# Altium schematic sheet Power Regulation.SchDoc
size A; SheetNumber: 2; SheetTotal: 4
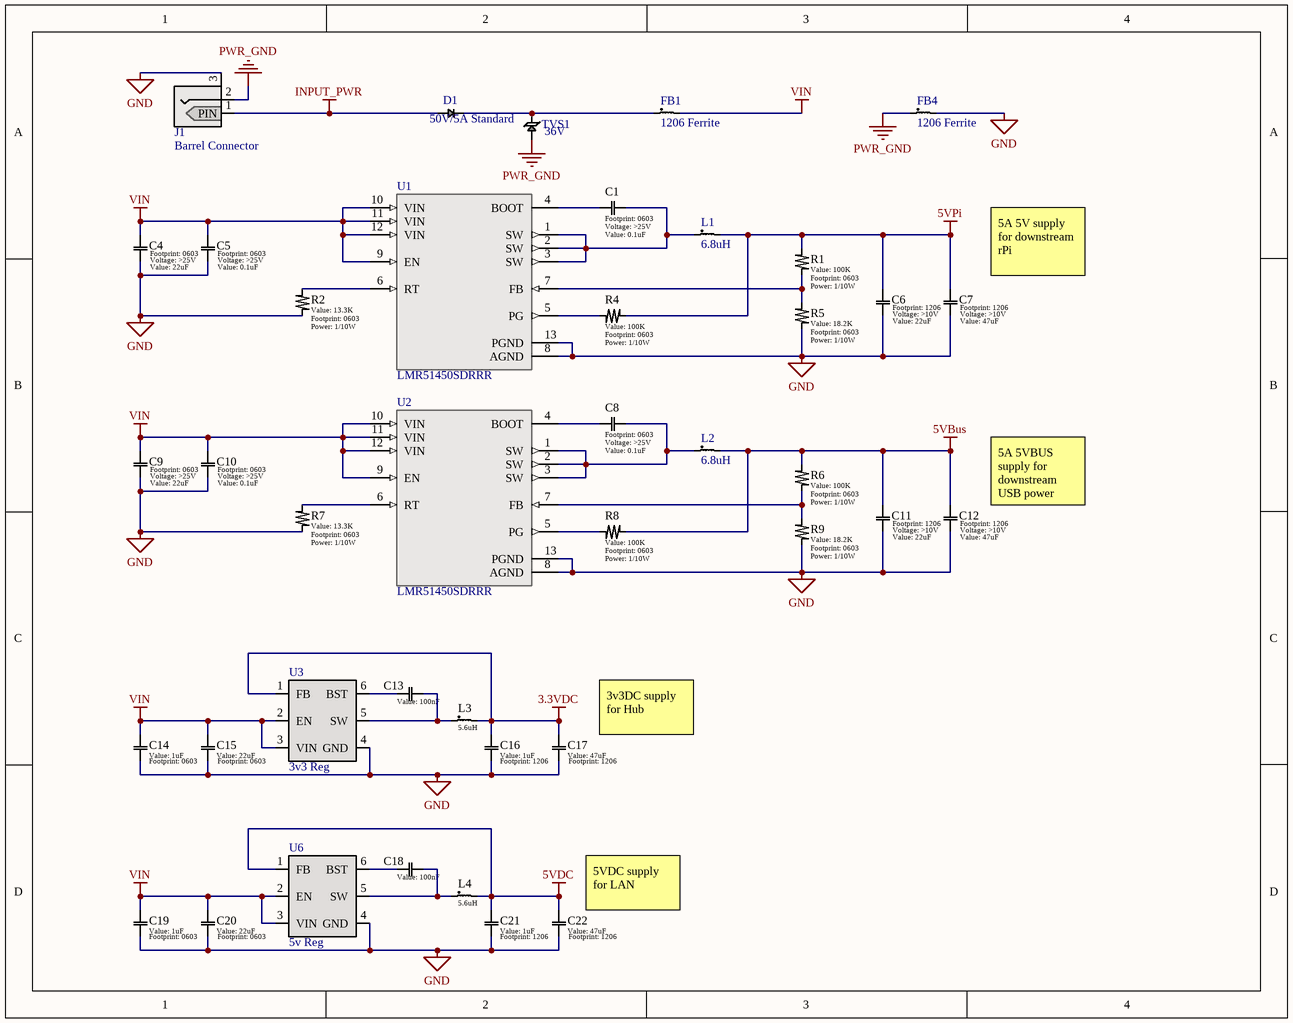
[diagram p0: Power Regulation.SchDoc]

## Parts
C1  value 0.1uF  Voltage: >25V  [0603]  (hidden comment: Generic Capacitor)
C4  value 22uF  Voltage: >25V  [0603]  (hidden comment: Generic Capacitor)
C5  value 0.1uF  Voltage: >25V  [0603]  (hidden comment: Generic Capacitor)
C6  value 22uF  Voltage: >10V  [1206]  (hidden comment: Generic Capacitor)
C7  value 47uF  Voltage: >10V  [1206]  (hidden comment: Generic Capacitor)
C8  value 0.1uF  Voltage: >25V  [0603]  (hidden comment: Generic Capacitor)
C9  value 22uF  Voltage: >25V  [0603]  (hidden comment: Generic Capacitor)
C10  value 0.1uF  Voltage: >25V  [0603]  (hidden comment: Generic Capacitor)
C11  value 22uF  Voltage: >10V  [1206]  (hidden comment: Generic Capacitor)
C12  value 47uF  Voltage: >10V  [1206]  (hidden comment: Generic Capacitor)
C13  value 100nF  [0603]  (hidden comment: Generic Capacitor)
C14  value 1uF  [0603]  (hidden comment: Generic Capacitor)
C15  value 22uF  [0603]  (hidden comment: Generic Capacitor)
C16  value 1uF  [1206]  (hidden comment: Generic Capacitor)
C17  value 47uF  [1206]  (hidden comment: Generic Capacitor)
C18  value 100nF  [0603]  (hidden comment: Generic Capacitor)
C19  value 1uF  [0603]  (hidden comment: Generic Capacitor)
C20  value 22uF  [0603]  (hidden comment: Generic Capacitor)
C21  value 1uF  [1206]  (hidden comment: Generic Capacitor)
C22  value 47uF  [1206]  (hidden comment: Generic Capacitor)
D1  50V/5A Standard  [DO-214AC]
FB1  1206 Ferrite  [1206]
FB4  1206 Ferrite  [1206]
J1  Barrel Connector  [PJ-082BH]
L1  6.8uH  [IHLP3232DZER6R8M11]
L2  6.8uH  [IHLP3232DZER6R8M11]
L3  5.6uH  [TMPC0402HP]
L4  5.6uH  [TMPC0402HP]
R1  value 100K  Power: 1/10W  [0603]  (hidden comment: Generic Resistor)
R2  value 13.3K  Power: 1/10W  [0603]  (hidden comment: Generic Resistor)
R4  value 100K  Power: 1/10W  [0603]  (hidden comment: Generic Resistor)
R5  value 18.2K  Power: 1/10W  [0603]  (hidden comment: Generic Resistor)
R6  value 100K  Power: 1/10W  [0603]  (hidden comment: Generic Resistor)
R7  value 13.3K  Power: 1/10W  [0603]  (hidden comment: Generic Resistor)
R8  value 100K  Power: 1/10W  [0603]  (hidden comment: Generic Resistor)
R9  value 18.2K  Power: 1/10W  [0603]  (hidden comment: Generic Resistor)
TVS1  36V  [DO-214AC]
U1  LMR51450SDRRR  [WSON-12]
U2  LMR51450SDRRR  [WSON-12]
U3  3v3 Reg  [TSOT-23-6]
U6  5v Reg  [TSOT-23-6]

## Nets
3.3VDC: C16.1 C17.1 L3.2 U3.1(FB)
5VBus: C11.1 C12.1 L2.2 R6.2 R8.1
5VDC: C21.1 C22.1 L4.2 U6.1(FB)
5VPi: C6.1 C7.1 L1.2 R1.2 R4.1
GND: C4.2 C5.2 C6.2 C7.2 C9.2 C10.2 C11.2 C12.2 C14.2 C15.2 C16.2 C17.2 C19.2 C20.2 C21.2 C22.2 FB4.2 J1.3(SHD_B) R2.1 R5.1 R7.1 R9.1 U1.8(AGND) U1.13(PGND) U2.8(AGND) U2.13(PGND) U3.4(GND) U6.4(GND)
INPUT_PWR: D1.2(Anode) J1.1(PIN)
PWR_GND: FB4.1 J1.2(SHD_A) TVS1.2(Anode)
VIN: C4.1 C5.1 C9.1 C10.1 C14.1 C15.1 C19.1 C20.1 FB1.2 U1.9(EN) U1.10(VIN) U1.11(VIN) U1.12(VIN) U2.9(EN) U2.10(VIN) U2.11(VIN) U2.12(VIN) U3.2(EN) U3.3(VIN) U6.2(EN) U6.3(VIN)
NetC1_1: C1.1 U1.4(BOOT)
NetC1_2: C1.2 L1.1 U1.1(SW) U1.2(SW) U1.3(SW)
NetC8_1: C8.1 U2.4(BOOT)
NetC8_2: C8.2 L2.1 U2.1(SW) U2.2(SW) U2.3(SW)
NetC13_1: C13.1 U3.6(BST)
NetC13_2: C13.2 L3.1 U3.5(SW)
NetC18_1: C18.1 U6.6(BST)
NetC18_2: C18.2 L4.1 U6.5(SW)
NetD1_1: D1.1(Cathode) FB1.1 TVS1.1(Cathode)
NetR1_1: R1.1 R5.2 U1.7(FB)
NetR2_2: R2.2 U1.6(RT)
NetR4_2: R4.2 U1.5(PG)
NetR6_1: R6.1 R9.2 U2.7(FB)
NetR7_2: R7.2 U2.6(RT)
NetR8_2: R8.2 U2.5(PG)

## Notes on the sheet
- (near C7) 5A 5V supply for downstream rPi
- (near C12) 5A 5VBUS supply for downstream USB power
- (near C17) 3v3DC supply for Hub
- (near C22) 5VDC supply for LAN
- REV
- REVISIONS
- DATE
- DESCRIPTION
- BY
- UNLESS OTHERWISE SPECIFIED, DRAWING DEFINITIONS AND TOLERANCES SHALL BE FOUND UNDER SUPPLIER STANDARDS SS-001. THIS PART AND ALL COMPONENTS OF IT MUST BE RoHS & REACH COMPLIANT. A CERTIFICATE OF COMPLIANCE MUST BE PROVIDED UPON REQUEST.
- ALL INFORMATION ON THIS DOCUMENT IS THE SOLE PROPERTY OF GAMBER-JOHNSON AND SHALL NOT BE COPIED, REPRODUCED, USED OR DISCLOSED IN WHOLE OR IN PART WITHOUT THE WRITTEN CONSENT OF GAMBER-JOHNSON
- TOLERANCES
  .00 ± .060
  .000 ± .020
  .0000 ± .005
  ANGELS ± 1°
- DRAWN BY:
- PROJECT NUMBER:
- SHEET TITLE:
- SHEET
- OF
- DATE:
- LOCATION:
- ASSEMBLY NUMBER
- SIZE
- GAMBER-JOHNSON LLC
  5001 Joerns Dr
  STEVENS POINT, WI 54481
  +1 (715) 344-5209
- A

## Library data of the parts
C1 C4 C5 C7-C10 C12 = Generic Capacitor: Tolerance: 10%
C6 C11 = Generic Capacitor: Tolerance: 20%
C13-C22 = Generic Capacitor: Voltage: >10V; Tolerance: 10%
D1 = SBRT5A50SA-13: Diode Super Barrier 50V 5A Surface Mount; Manufacturer 1: Diodes; Element Configuration: Single; Forward Voltage: 460mV; Max Forward Surge Current (Ifsm): 70A; Max Reverse Current: 45mA; Supplier 1: Digi-Key; Manufacturer Part Number 1: SBRT5A50SA-13; RoHS: Yes; Category: Rectifier Diodes; Stock 1: 218992; Pricing 1: 1=0.49000, 10=0.38200, 100=0.22900, 500=0.21200, 1000=0.14416, 2000=0.13271 (USD); Mount: Surface Mount; Case/Package: SMA; Weight: 0.002258oz; Min Operating Temperature: -55°C; Max Operating Temperature: 150°C; Packaging: Tape and Reel; Average Rectified Current: 5A; Max Repetitive Reverse Voltage (Vrrm): 50V; Package Quantity: 5000; Max Reverse Voltage (DC): 50V; Lead Free: Lead Free; RoHS Compliant: Yes; ComponentLink1URL: http://www.farnell.com/datasheets/2814462.pdf?src-supplier=Farnell; ComponentLink1Description: http://www.farnell.com/datasheets/2814462.pdf?src-supplier=Farnell; ComponentLink2URL: https://www.diodes.com/assets/Datasheets/SBRT5A50SA.pdf?src-supplier=Arrow+Electronics; ComponentLink2Description: https://www.diodes.com/assets/Datasheets/SBRT5A50SA.pdf?src-supplier=Arrow+Electronics; ComponentLink3URL: https://www.diodes.com/assets/Datasheets/SBRT5A50SA.pdf?src-supplier=Mouser; ComponentLink3Description: https://www.diodes.com/assets/Datasheets/SBRT5A50SA.pdf?src-supplier=Mouser; ComponentLink4URL: https://www.diodes.com/assets/Datasheets/SBRT5A50SA.pdf?src-supplier=Avnet+Europe; ComponentLink4Description: https://www.diodes.com/assets/Datasheets/SBRT5A50SA.pdf?src-supplier=Avnet+Europe; ComponentLink5URL: http://www.farnell.com/datasheets/2814462.pdf?src-supplier=Newark; ComponentLink5Description: http://www.farnell.com/datasheets/2814462.pdf?src-supplier=Newark; ComponentLink6URL: https://www.diodes.com/assets/Datasheets/SBRT5A50SA.pdf?src-supplier=Avnet; ComponentLink6Description: https://www.diodes.com/assets/Datasheets/SBRT5A50SA.pdf?src-supplier=Avnet; ComponentLink7URL: https://www.diodes.com/assets/Datasheets/SBRT5A50SA.pdf?src-supplier=Digi-Key; ComponentLink7Description: https://www.diodes.com/assets/Datasheets/SBRT5A50SA.pdf?src-supplier=Digi-Key; ComponentLink8URL: http://www.farnell.com/datasheets/2814462.pdf?src-supplier=Element14; ComponentLink8Description: http://www.farnell.com/datasheets/2814462.pdf?src-supplier=Element14; ComponentLink9URL: https://www.diodes.com/assets/Datasheets/SBRT5A50SA.pdf?src-supplier=Verical; ComponentLink9Description: https://www.diodes.com/assets/Datasheets/SBRT5A50SA.pdf?src-supplier=Verical; Supplier Part Number 1: SBRT5A50SA-13DICT-ND
FB1 FB4 = HI1206T161R-10: 160 Ohms @ 100MHz 1 Power, Signal Line Ferrite Bead 1206 (3216 Metric) 6A 18mOhm; Manufacturer 1: Laird Steward; DC Resistance (DCR): 18mR; Number of Lines: 1; Impedance: 160R; Supplier 1: Digi-Key; Manufacturer Part Number 1: HI1206T161R-10; RoHS: Yes; Category: Fixed Inductors; Stock 1: 250713; Pricing 1: 1=0.20000, 10=0.15600, 25=0.12920, 50=0.11140, 100=0.10020, 250=0.08464, 500=0.07572, 1000=0.06458 (USD); Mount: Surface Mount; Case/Package: 1206; Weight: 0.0136oz; Case Code (Metric): 3216; Case Code (Imperial): 1206; Core Material: Ferrite; Material: Ferrite; Min Operating Temperature: -40°C; Max Operating Temperature: 125°C; Package Quantity: 1; Packaging: Tape and Reel; Max Current Rating: 6A; Current Rating: 6A; Max DC Current: 6A; Termination: SMD/SMT; Frequency: 100MHz; Test Frequency: 100MHz; Length: 3.2mm; Height: 0.071inch; Width: 0.063inch; Depth: 1.8mm; Lead Free: Lead Free; REACH SVHC: Unknown; ComponentLink1URL: https://datasheet.ciiva.com/22622/1685743-22622771.pdf?src-supplier=Element14; ComponentLink1Description: https://datasheet.ciiva.com/22622/1685743-22622771.pdf?src-supplier=Element14; ComponentLink2URL: https://datasheet.ciiva.com/16714/70065439-16714326.pdf?src-supplier=Allied+Electronics; ComponentLink2Description: https://datasheet.ciiva.com/16714/70065439-16714326.pdf?src-supplier=Allied+Electronics; Supplier Part Number 1: 240-2411-1-ND; LCSC PN: C391193
J1 = PJ-082BH: CONN PWR JACK 2.5X5.5MM SOLDER; Manufacturer 1: CUI; Gender: Male; Shielding: Shielded; Current Rating: 10A; Number of Conductors: 2; Supplier 1: Digi-Key; Manufacturer Part Number 1: PJ-082BH; RoHS: Yes; Category: Connectors; Stock 1: 24371; Pricing 1: 1=1.69000, 10=1.53600, 25=1.44200, 50=1.37940, 100=1.31670 (USD); Mount: Through Hole; Color: Black; Contact Material: Brass; Housing Material: Nylon; Contact Plating: Silver; Housing Color: Black; Min Operating Temperature: -25°C; Max Operating Temperature: 85°C; Orientation: Horizontal; Connector Type: Jack; Termination: Solder; Lead Free: Lead Free; ComponentLink1URL: https://datasheet.ciiva.com/7368/pj-082bh-7368042.pdf?src-supplier=Digi-Key; ComponentLink1Description: https://datasheet.ciiva.com/7368/pj-082bh-7368042.pdf?src-supplier=Digi-Key; ComponentLink2URL: https://datasheet.ciiva.com/7368/pj-082bh-7368045.pdf?src-supplier=Digi-Key; ComponentLink2Description: https://datasheet.ciiva.com/7368/pj-082bh-7368045.pdf?src-supplier=Digi-Key; Supplier Part Number 1: CP-082BHCT-ND; LCSC PN: C3001296
L1 L2 = IHLP3232DZER6R8M11: FIXED IND 6.8UH 7A 33.4 MOHM SMD; Manufacturer 1: Vishay Dale; Core Material: Ferrite; Inductance Tolerance: 20%; Self Resonant Frequency: 13MHz; Shielding: Shielded; Saturation Current: 6.7A; DC Resistance (DCR): 33.4mR; Test Frequency: 100kHz; LCSC PN: C511015; Supplier 1: Digi-Key; Manufacturer Part Number 1: IHLP3232DZER6R8M11; RoHS: Yes; Category: Fixed Inductors; Stock 1: 9946; Pricing 1: 1=1.40000, 10=1.30000, 25=1.20000, 50=1.00000, 100=0.94000, 250=0.84000 (USD); Mount: Surface Mount; Case/Package: 3232; Number of Pins: 2; Min Operating Temperature: -55°C; Max Operating Temperature: 125°C; Package Quantity: 500; Packaging: Tape and Reel; Tolerance: 20%; Current Rating: 7A; Inductance: 6.8uH; Max DC Current: 6.7A; Termination: SMD/SMT; RMS Current (Irms): 7A; Series: IHLP-3232DZ-11; Rated Current-Max: 7A; Length: 0.34inch; Width: 8.18mm; Height: 4mm; Height - Seated (Max): 0.157inch; Depth: 8.26mm; Radiation Hardening: No; REACH SVHC: Unknown; Military Standard: Not; Lead Free: Lead Free; RoHS Compliant: Yes; ComponentLink1URL: https://datasheet.ciiva.com/5763/ihlp3232dz11-5763504.pdf?src-supplier=Farnell; ComponentLink1Description: https://datasheet.ciiva.com/5763/ihlp3232dz11-5763504.pdf?src-supplier=Farnell; ComponentLink2URL: https://datasheet.ciiva.com/1058/ihlp-3232dz-11-1058078.pdf?src-supplier=Digi-Key; ComponentLink2Description: https://datasheet.ciiva.com/1058/ihlp-3232dz-11-1058078.pdf?src-supplier=Digi-Key; ComponentLink3URL: https://datasheet.ciiva.com/1058/ihlp-3232dz-11-1058079.pdf?src-supplier=Digi-Key; ComponentLink3Description: https://datasheet.ciiva.com/1058/ihlp-3232dz-11-1058079.pdf?src-supplier=Digi-Key; ComponentLink4URL: https://datasheet.ciiva.com/1058/ihlp-3232dz-11-1058077.pdf?src-supplier=Digi-Key; ComponentLink4Description: https://datasheet.ciiva.com/1058/ihlp-3232dz-11-1058077.pdf?src-supplier=Digi-Key; ComponentLink5URL: https://datasheet.ciiva.com/8495/ihlp3232dz11-8495151.pdf?src-supplier=Avnet; ComponentLink5Description: https://datasheet.ciiva.com/8495/ihlp3232dz11-8495151.pdf?src-supplier=Avnet; ComponentLink6URL: https://datasheet.ciiva.com/8017/ihlp3232dz11-8017326.pdf?src-supplier=Element14; ComponentLink6Description: https://datasheet.ciiva.com/8017/ihlp3232dz11-8017326.pdf?src-supplier=Element14; Supplier Part Number 1: 541-1355-1-ND
L3 L4 = TMPC0402HP-5R6MG-Z02: 2A 5.6uH ±20% SMD Power Inductor; LCSC PN: C357137; Supplier 1: Digi-Key; Supplier Part Number 1: 732-3339-1-ND
R1 R2 R4-R9 = Generic Resistor: Tolerance: 1%
TVS1 = SMAJ36A: 58.1V Clamp 6.9A Ipp Tvs Diode Surface Mount DO-214AC (SMA); Manufacturer 1: Littelfuse; Peak Pulse Power: 400W; Polarity: Unidirectional; Breakdown Voltage: 40V; Test Current: 1mA; Number of Channels: 1; Leakage Current: 1uA; Max Power Dissipation: 3.3W; Power Line Protection: No; Max Breakdown Voltage: 44.2V; Supplier 1: Digi-Key; Manufacturer Part Number 1: SMAJ36A; RoHS: Yes; Category: TVS Diodes; Stock 1: 65200; Pricing 1: 1=0.41000, 10=0.27500, 100=0.15750, 500=0.11000, 1000=0.08750, 2000=0.08500 (USD); Mount: Surface Mount; Number of Pins: 2; Min Operating Temperature: -65°C; Max Operating Temperature: 150°C; Clamping Voltage: 58.1V; Packaging: Tape and Reel; Reverse Standoff Voltage: 36V; Peak Pulse Current: 6.9A; Max Surge Current: 6.9A; Package Quantity: 5000; Operating Supply Voltage: 36V; Reverse Breakdown Voltage: 40V; Min Breakdown Voltage: 40V; Number of Elements: 1; Termination: SMD/SMT; Direction: Unidirectional; Resistor Type: Zener; Number of Unidirectional Channels: 1; Voltage Rating (DC): 36V; Power Dissipation: 400W; Length: 5.28mm; Height: 2.29mm; Width: 2.79mm; Lead Free: Lead Free; REACH SVHC: No SVHC; ComponentLink1URL: https://datasheet.ciiva.com/330/littelfuse-tvs-diode-smaj-datasheet-pdf-330760.pdf?src-supplier=Digi-Key; ComponentLink1Description: https://datasheet.ciiva.com/330/littelfuse-tvs-diode-smaj-datasheet-pdf-330760.pdf?src-supplier=Digi-Key; ComponentLink2URL: https://datasheet.ciiva.com/330/littelfuse-tvs-diode-smaj-datasheet-pdf-330762.pdf?src-supplier=Digi-Key; ComponentLink2Description: https://datasheet.ciiva.com/330/littelfuse-tvs-diode-smaj-datasheet-pdf-330762.pdf?src-supplier=Digi-Key; ComponentLink3URL: https://datasheet.ciiva.com/28473/607617-28473423.pdf?src-supplier=Element14; ComponentLink3Description: https://datasheet.ciiva.com/28473/607617-28473423.pdf?src-supplier=Element14; ComponentLink4URL: https://datasheet.ciiva.com/330/littelfuse-tvs-diode-smaj-datasheet-pdf-330761.pdf?src-supplier=Digi-Key; ComponentLink4Description: https://datasheet.ciiva.com/330/littelfuse-tvs-diode-smaj-datasheet-pdf-330761.pdf?src-supplier=Digi-Key; ComponentLink5URL: https://datasheet.ciiva.com/16487/littelfuse-tvs-diode-smaj-16487437.pdf?src-supplier=Future+Electronics; ComponentLink5Description: https://datasheet.ciiva.com/16487/littelfuse-tvs-diode-smaj-16487437.pdf?src-supplier=Future+Electronics; Supplier Part Number 1: SMAJ36ALFCT-ND
U1 U2 = LMR51450SDRRR: 36-V, 5-A synchronous buck converter; MF: Texas Instruments; SnapEDA_Link: https://www.snapeda.com/parts/LMR51450SDRRR/Texas+Instruments/view-part/?ref=snap; Package: WSON-12 Texas Instruments; Value: *; MP: LMR51450SDRRR; Check_prices: https://www.snapeda.com/parts/LMR51450SDRRR/Texas+Instruments/view-part/?ref=eda; LCSC PN: C6890985
U3 = AP63203WU-7: Switching Voltage Regulators DCDC Conv HV Buck TSOT26 T&R 3K; Manufacturer_Name: Diodes Inc.; Geometry.Height: 1mm; Manufacturer_Part_Number: AP63203WU-7; Mouser Part Number: 621-AP63203WU-7; Mouser Price/Stock: https://www.mouser.co.uk/ProductDetail/Diodes-Incorporated/AP63203WU-7?qs=u16ybLDytRZ1JqxbuLkMJw%3D%3D; Arrow Part Number: AP63203WU-7; Arrow Price/Stock: https://www.arrow.com/en/products/ap63203wu-7/diodes-incorporated?region=asia; Datasheet Link: https://componentsearchengine.com/Datasheets/1/AP63203WU-7.pdf; LCSC PN: C780769
U6 = AP63205WU-7: Step-down type Fixed 2A 5V 3.8V~32V; Mfr_Name: Diodes Inc; Copyright: Copyright (C) 2023 Ultra Librarian. All rights reserved.; Manufacturer_Part_Number: AP63205WU-7; RefDes: RefDes; Type: DEV; LCSC PN: C2071056